# EAGLE design dam1021 (EAGLE 7.4.0)

## Sheet 1 of 2
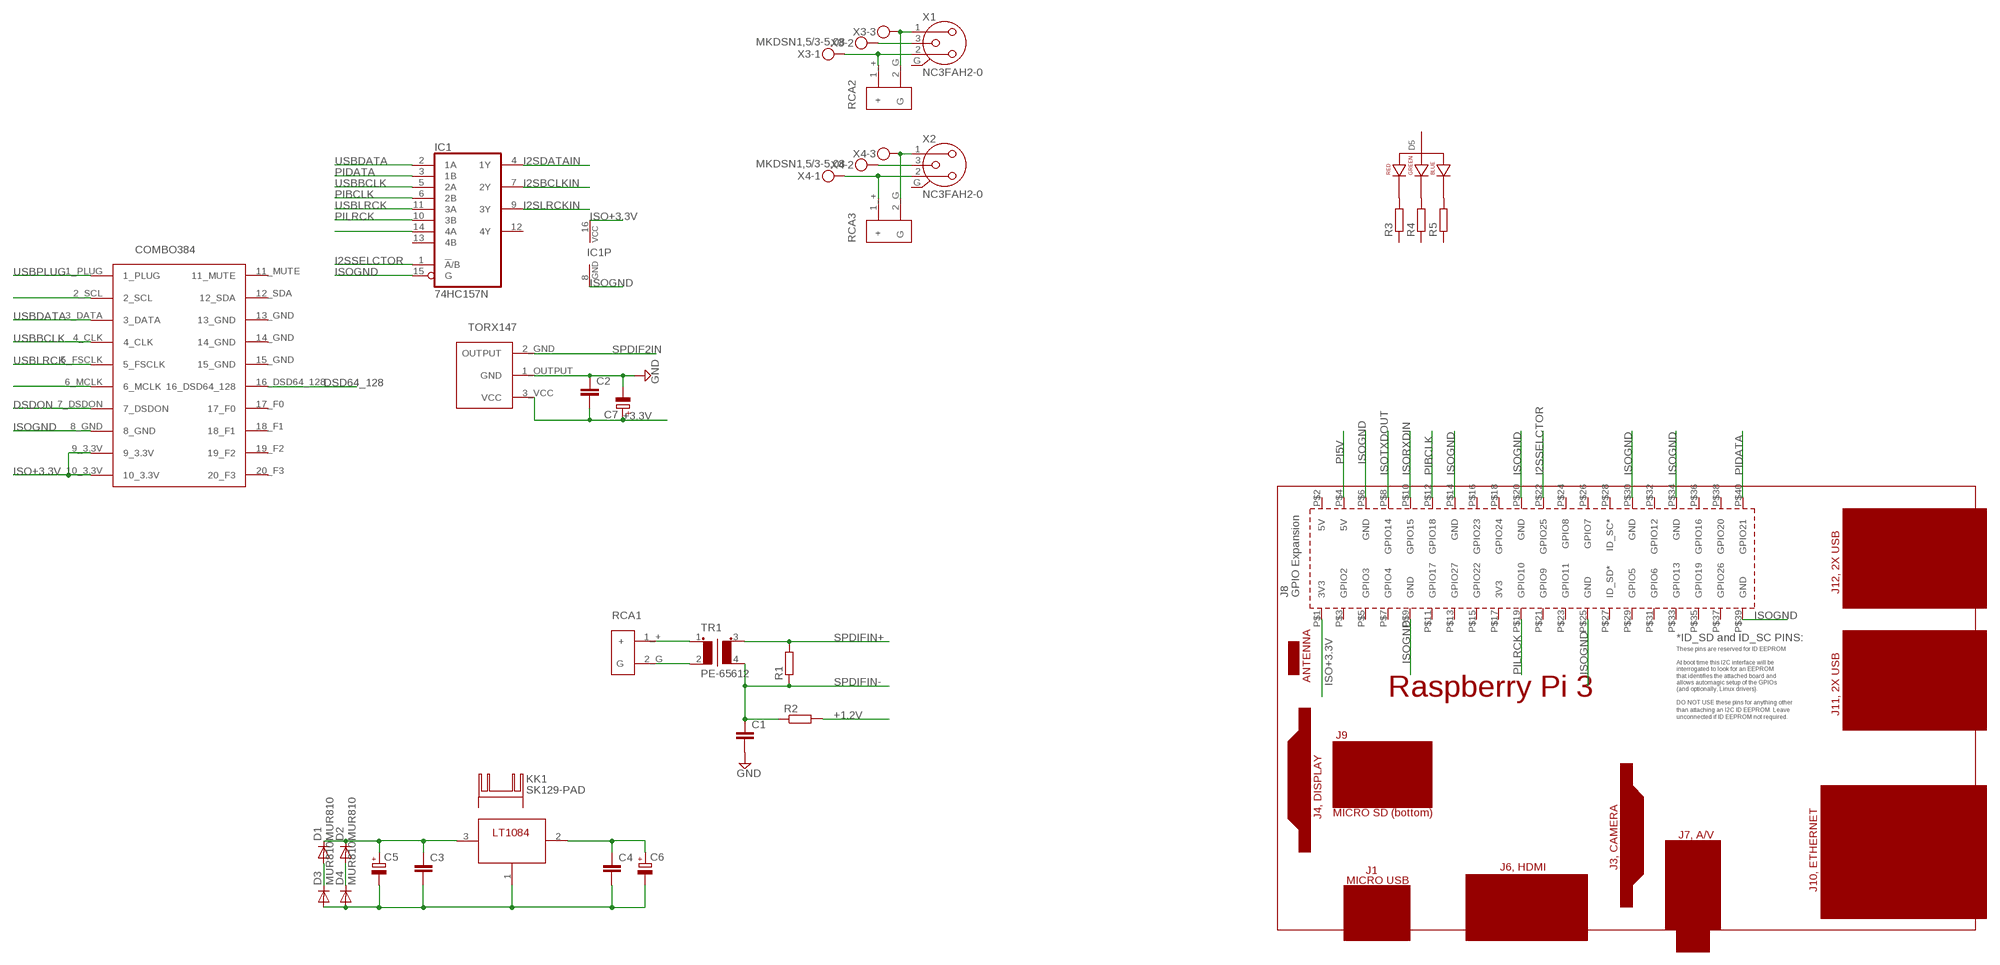
[diagram p0: schematic, sheet 1]

### Parts
C1  C-EU050-035X075  [C050-035X075]
C2  C-EU050-035X075  [C050-035X075]
C3  C-EU050-035X075  [C050-035X075]
C4  C-EU050-035X075  [C050-035X075]
C5  CPOL-EUE7.5-16  [E7,5-16]
C6  CPOL-EUE5-10.5  [E5-10,5]
C7  CPOL-EUE2.5-7  [E2,5-7]
D1  MUR810  [TO220ACS]
D2  MUR810  [TO220ACS]
D3  MUR810  [TO220ACS]
D4  MUR810  [TO220ACS]
D5  LED-RGB-CA-THRUCLEAR  [LED-RGB-THRU]
IC1  74HC157N  [DIL16]
KK1  SK129-PAD  [SK129]
PCB1  RPI3  [RPI3]
R1  R-EU_0207/10  [0207/10]
R2  R-EU_0207/10  [0207/10]
R3  R-EU_0207/10  [0207/10]
R4  R-EU_0207/10  [0207/10]
R5  R-EU_0207/10  [0207/10]
RCA1  RCA  [RCA]
RCA2  RCA  [RCA]
RCA3  RCA  [RCA]
TR1  PE-65612  [PE-65612]
U$2  TORX147  [TORX147]
U$3  COMBO384  [COMBO384]
U$5  LT1084  [TO-220]
X1  NC3FAH2-0  [NC3FAH2-0]
X2  NC3FAH2-0  [NC3FAH2-0]
X3  MKDSN1,5/3-5,08  [MKDSN1,5/3-5,08]
X4  MKDSN1,5/3-5,08  [MKDSN1,5/3-5,08]

### Nets
+1.2V: R2.2 ; also sheet 2
+3.3V: C2.2 C7.+ U$2.3_VCC(VCC) ; also sheet 2
AGND: RCA2.2_G(G) RCA3.2_G(G) X1.1 X2.1 X3.3 X4.3 ; also sheet 2
DSD64_128: U$3.16_DSD64_128
DSDON: U$3.7_DSDON
GND: C1.2 C2.1 C7.- U$2.1_OUTPUT(GND) ; also sheet 2
I2SBCLKIN: IC1.7(2Y) ; also sheet 2
I2SDATAIN: IC1.4(1Y) ; also sheet 2
I2SLRCKIN: IC1.9(3Y) ; also sheet 2
I2SSELCTOR: IC1.1(!A!/B) PCB1.P$22(GPIO25)
ISO+3.3V: IC1.16(VCC) PCB1.P$1(3V3) U$3.9_3.3V U$3.10_3.3V ; also sheet 2
ISOGND: C3.2 C4.2 C5.- C6.- D3.A D4.A IC1.8(GND) IC1.15(G) PCB1.P$6(GND) PCB1.P$9(GND) PCB1.P$14(GND) PCB1.P$20(GND) PCB1.P$25(GND) PCB1.P$30(GND) PCB1.P$34(GND) PCB1.P$39(GND) U$3.8_GND U$5.1 ; also sheet 2
ISORXDIN: PCB1.P$10(GPIO15) ; also sheet 2
ISOTXDOUT: PCB1.P$8(GPIO14) ; also sheet 2
N$1: RCA1.1_+(+) TR1.1
N$2: U$3.2_SCL
N$3: RCA1.2_G(G) TR1.2
N$4: D5.1(RED_CATHODE) R3.2
N$6: U$3.6_MCLK
N$7: D5.3(GREEN_CATHODE) R4.2
N$8: C3.1 C5.+ D1.C D2.C U$5.3
N$9: D1.A D3.C
N$10: D2.A D4.C
N$11: IC1.14(4A)
N$12: D5.4(BLUE_CATHODE) R5.2
N$15: X1.3 X3.2
N$16: RCA2.1_+(+) X1.2 X3.1
N$18: X2.3 X4.2
N$19: RCA3.1_+(+) X2.2 X4.1
PI5V: C4.1 C6.+ PCB1.P$4(5V) U$5.2
PIBCLK: IC1.6(2B) PCB1.P$12(GPIO18)
PIDATA: IC1.3(1B) PCB1.P$40(GPIO21)
PILRCK: IC1.10(3B) PCB1.P$19(GPIO10)
SPDIF2IN: U$2.2_GND(OUTPUT) ; also sheet 2
SPDIFIN+: R1.2 TR1.3 ; also sheet 2
SPDIFIN-: C1.1 R1.1 R2.1 TR1.4 ; also sheet 2
USBBCLK: IC1.5(2A) U$3.4_CLK
USBDATA: IC1.2(1A) U$3.3_DATA
USBLRCK: IC1.11(3A) U$3.5_FSCLK
USBPLUG: U$3.1_PLUG
Unconnected: D5.2(ANODE) IC1.12(4Y) IC1.13(4B) KK1.A2,5(K) KK1.B2,5(K) PCB1.P$2(5V) PCB1.P$3(GPIO2) PCB1.P$5(GPIO3) PCB1.P$7(GPIO4) PCB1.P$11(GPIO17) PCB1.P$13(GPIO27) PCB1.P$15(GPIO22) PCB1.P$16(GPIO23) PCB1.P$17(3V3) PCB1.P$18(GPIO24) PCB1.P$21(GPIO9) PCB1.P$23(GPIO11) PCB1.P$24(GPIO8) PCB1.P$26(GPIO7) PCB1.P$27(ID_SD*) PCB1.P$28(ID_SC*) PCB1.P$29(GPIO5) PCB1.P$31(GPIO6) PCB1.P$32(GPIO12) PCB1.P$33(GPIO13) PCB1.P$35(GPIO19) PCB1.P$36(GPIO16) PCB1.P$37(GPIO26) PCB1.P$38(GPIO20) R3.1 R4.1 R5.1 U$3.11_MUTE U$3.12_SDA U$3.13_GND U$3.14_GND U$3.15_GND U$3.17_F0 U$3.18_F1 U$3.19_F2 U$3.20_F3 X1.G X2.G

## Sheet 2 of 2
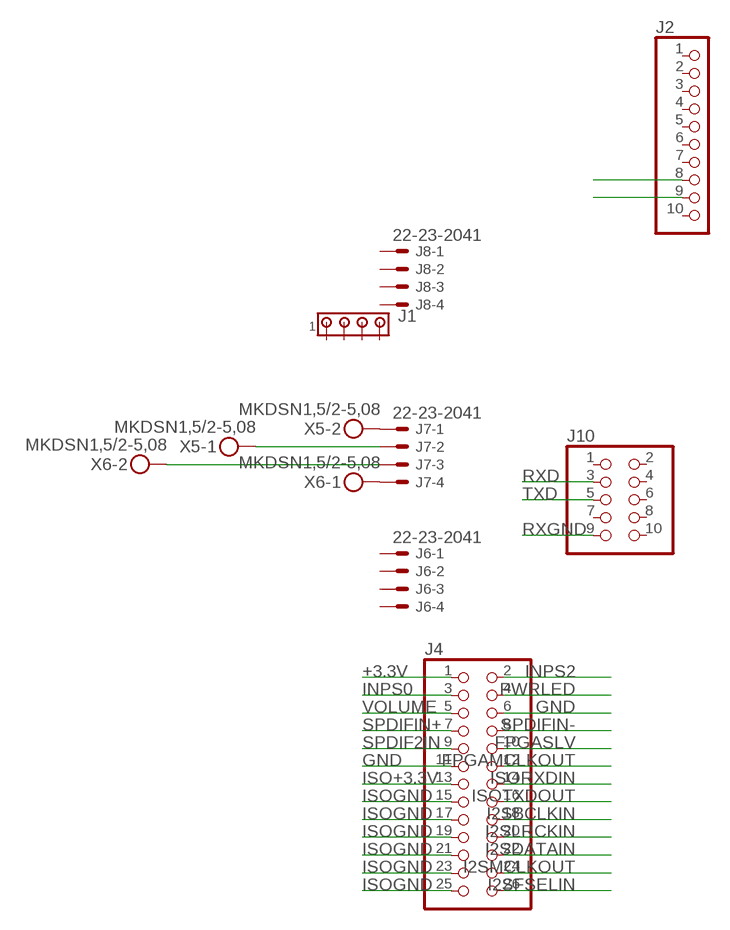
[diagram p1: schematic, sheet 2]

### Parts
J1  MTA04-156  [1X4MTA]
J2  PINHD-1X10  [1X10]
J4  PINHD-2X13  [2X13]
J6  22-23-2041  [22-23-2041]
J7  22-23-2041  [22-23-2041]
J8  22-23-2041  [22-23-2041]
J10  PINHD-2X5  [2X05]
X5  MKDSN1,5/2-5,08  [MKDSN1,5/2-5,08]
X6  MKDSN1,5/2-5,08  [MKDSN1,5/2-5,08]

### Nets
+1.2V: J2.9 ; also sheet 1
+3.3V: J2.8 J4.1 ; also sheet 1
AGND: J7.2 J7.3 X5.1 X6.2 ; also sheet 1
FPGAMCLKOUT: J4.12
FPGASLV: J4.10
GND: J4.6 J4.11 ; also sheet 1
I2SBCLKIN: J4.18 ; also sheet 1
I2SDATAIN: J4.22 ; also sheet 1
I2SFSELIN: J4.26
I2SLRCKIN: J4.20 ; also sheet 1
I2SMCLKOUT: J4.24
INPS0: J4.3
INPS2: J4.2
ISO+3.3V: J4.13 ; also sheet 1
ISOGND: J4.15 J4.17 J4.19 J4.21 J4.23 J4.25 ; also sheet 1
ISORXDIN: J4.14 ; also sheet 1
ISOTXDOUT: J4.16 ; also sheet 1
N$5: J7.1 X5.2
N$13: J7.4 X6.1
PWRLED: J4.4
RXD: J10.3
RXGND: J10.9
SPDIF2IN: J4.9 ; also sheet 1
SPDIFIN+: J4.7 ; also sheet 1
SPDIFIN-: J4.8 ; also sheet 1
TXD: J10.5
VOLUME: J4.5
Unconnected: J1.1 J1.2 J1.3 J1.4 J2.1 J2.2 J2.3 J2.4 J2.5 J2.6 J2.7 J2.10 J6.1 J6.2 J6.3 J6.4 J8.1 J8.2 J8.3 J8.4 J10.1 J10.2 J10.4 J10.6 J10.7 J10.8 J10.10

## Library data of the parts
C1-C4 = Vwvwbg:C-EU: CAPACITOR, European symbol
C5-C7 = Vwvwbg:CPOL-EU: POLARIZED CAPACITOR, European symbol
D1-D4 = diode:MUR810: DIODE
D5 = SparkFun-LED:LED-RGB-CA-THRU: RGB Through-hole common anode SparkFun store front COM-10821 (diffuse) COM-10820 (clear); PROD_ID: DIO-10631
IC1 = 74xx-eu:74*157: Quadruple 2-line to 1-line data SELECTOR/MULTIPLEXER
J1 = con-amp:MTA04-156: AMP connector
J2 = pinhead:PINHD-1X10: PIN HEADER
J4 = pinhead:PINHD-2X13: PIN HEADER
J6-J8 = con-molex:22-23-2041: .100" (2.54mm) Center Header - 4 Pin; MF: MOLEX; MPN: 22-23-2041; OC_FARNELL: 1462920; OC_NEWARK: 38C0355
J10 = pinhead:PINHD-2X5: PIN HEADER
KK1 = heatsinkfix:SK129-PAD: HEATSINK manufacturer Fischer/distributor Buerklin
PCB1 = e14_Rpi3_RevA:RPI3: Device for Raspberry Pi 3 board created by Dave Young for www.element14.com More information and support community is available at https://www.element14.com/community/community/raspberry-pi
R1-R5 = Vwvwbg:R-EU_: RESISTOR, European symbol
RCA1-RCA3 = Vwvwbg:RCA
TR1 = transformer-pulse:PE-65612: TRANSFORMERS FOR DIGITAL AUDIO DATA TRANSMISSION Source: Data sheet <http://ww2.pulseeng.com/products/datasheets/T601.pdf> www.pulseeng.com
U$2 = Vwvwbg:TORX147
U$3 = Vwvwbg:COMBO384
U$5 = GuShH:LT1084
X1 X2 = con-neutrik_ag:NC3: Neutrik Audio Connector XLR SERIES Stereo 1/4" jack Source: www.neutrik.com/; MPN: NC3FAH-2-0; OC_FARNELL: unknown; OC_NEWARK: 11J5829
X3 X4 = con-phoenix-508:MKDSN1,5/3-5,08: MKDSN 1,5/ 3-5,08 Printklemme Nennstrom: 13,5 A Nennspannung: 250 V Rastermaß: 5,08 mm Polzahl: 3 Anschlussart: Schraubanschluss Montage: Löten Anschlussrichtung Leiter/Platine: 0 ° Artikelnummer: 1729131 Source: http://eshop.phoenixcontact.com .. 1729131.pdf
X5 X6 = con-phoenix-508:MKDSN1,5/2-5,08: MKDSN 1,5/ 2-5,08 Printklemme Nennstrom: 13,5 A Nennspannung: 250 V Rastermaß: 5,08 mm Polzahl: 2 Anschlussart: Schraubanschluss Montage: Löten Anschlussrichtung Leiter/Platine: 0 ° Artikelnummer: 1729128 Source: http://eshop.phoenixcontact.com .. 1729128.pdf

## Board
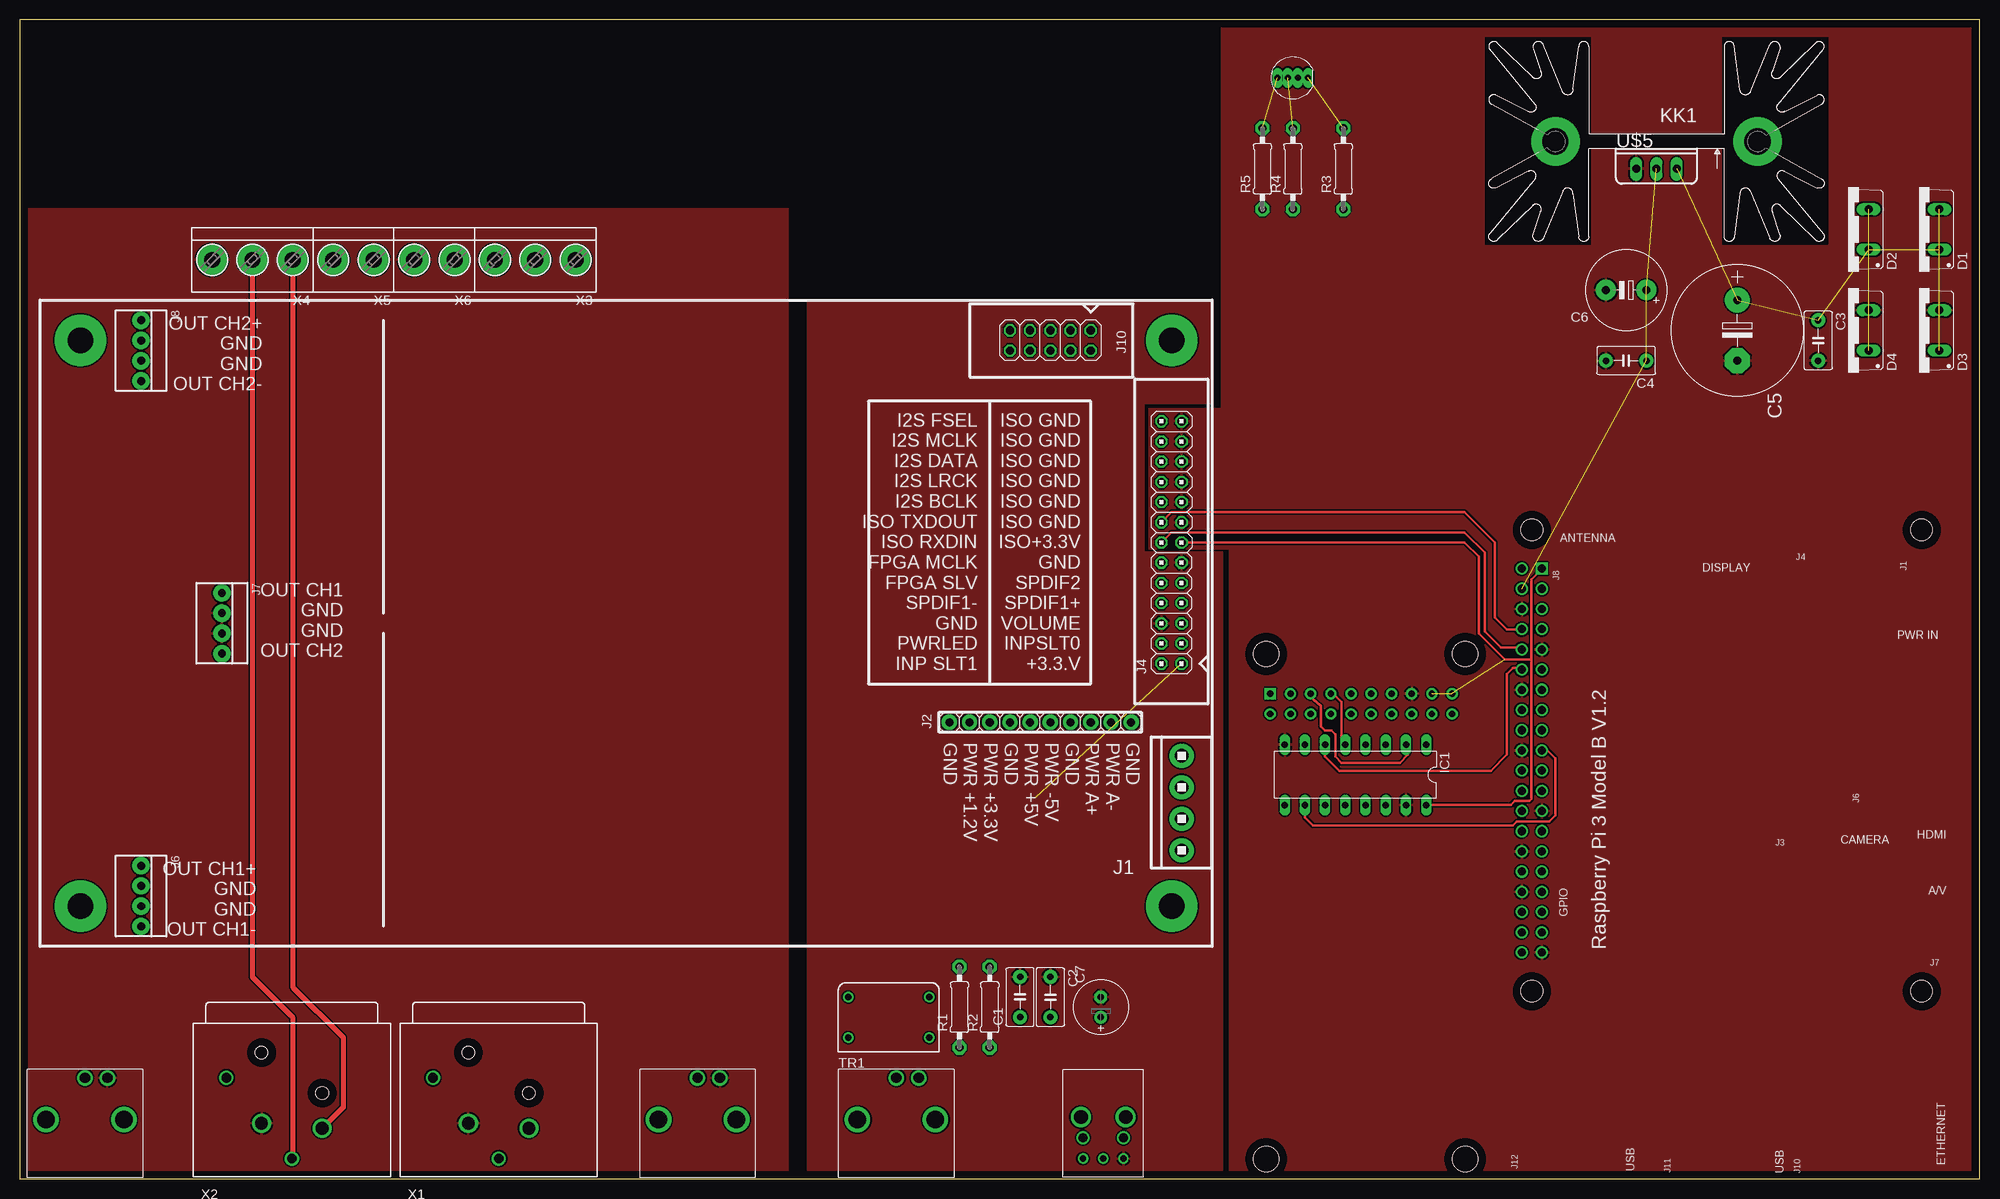
[diagram p2: board, top side]
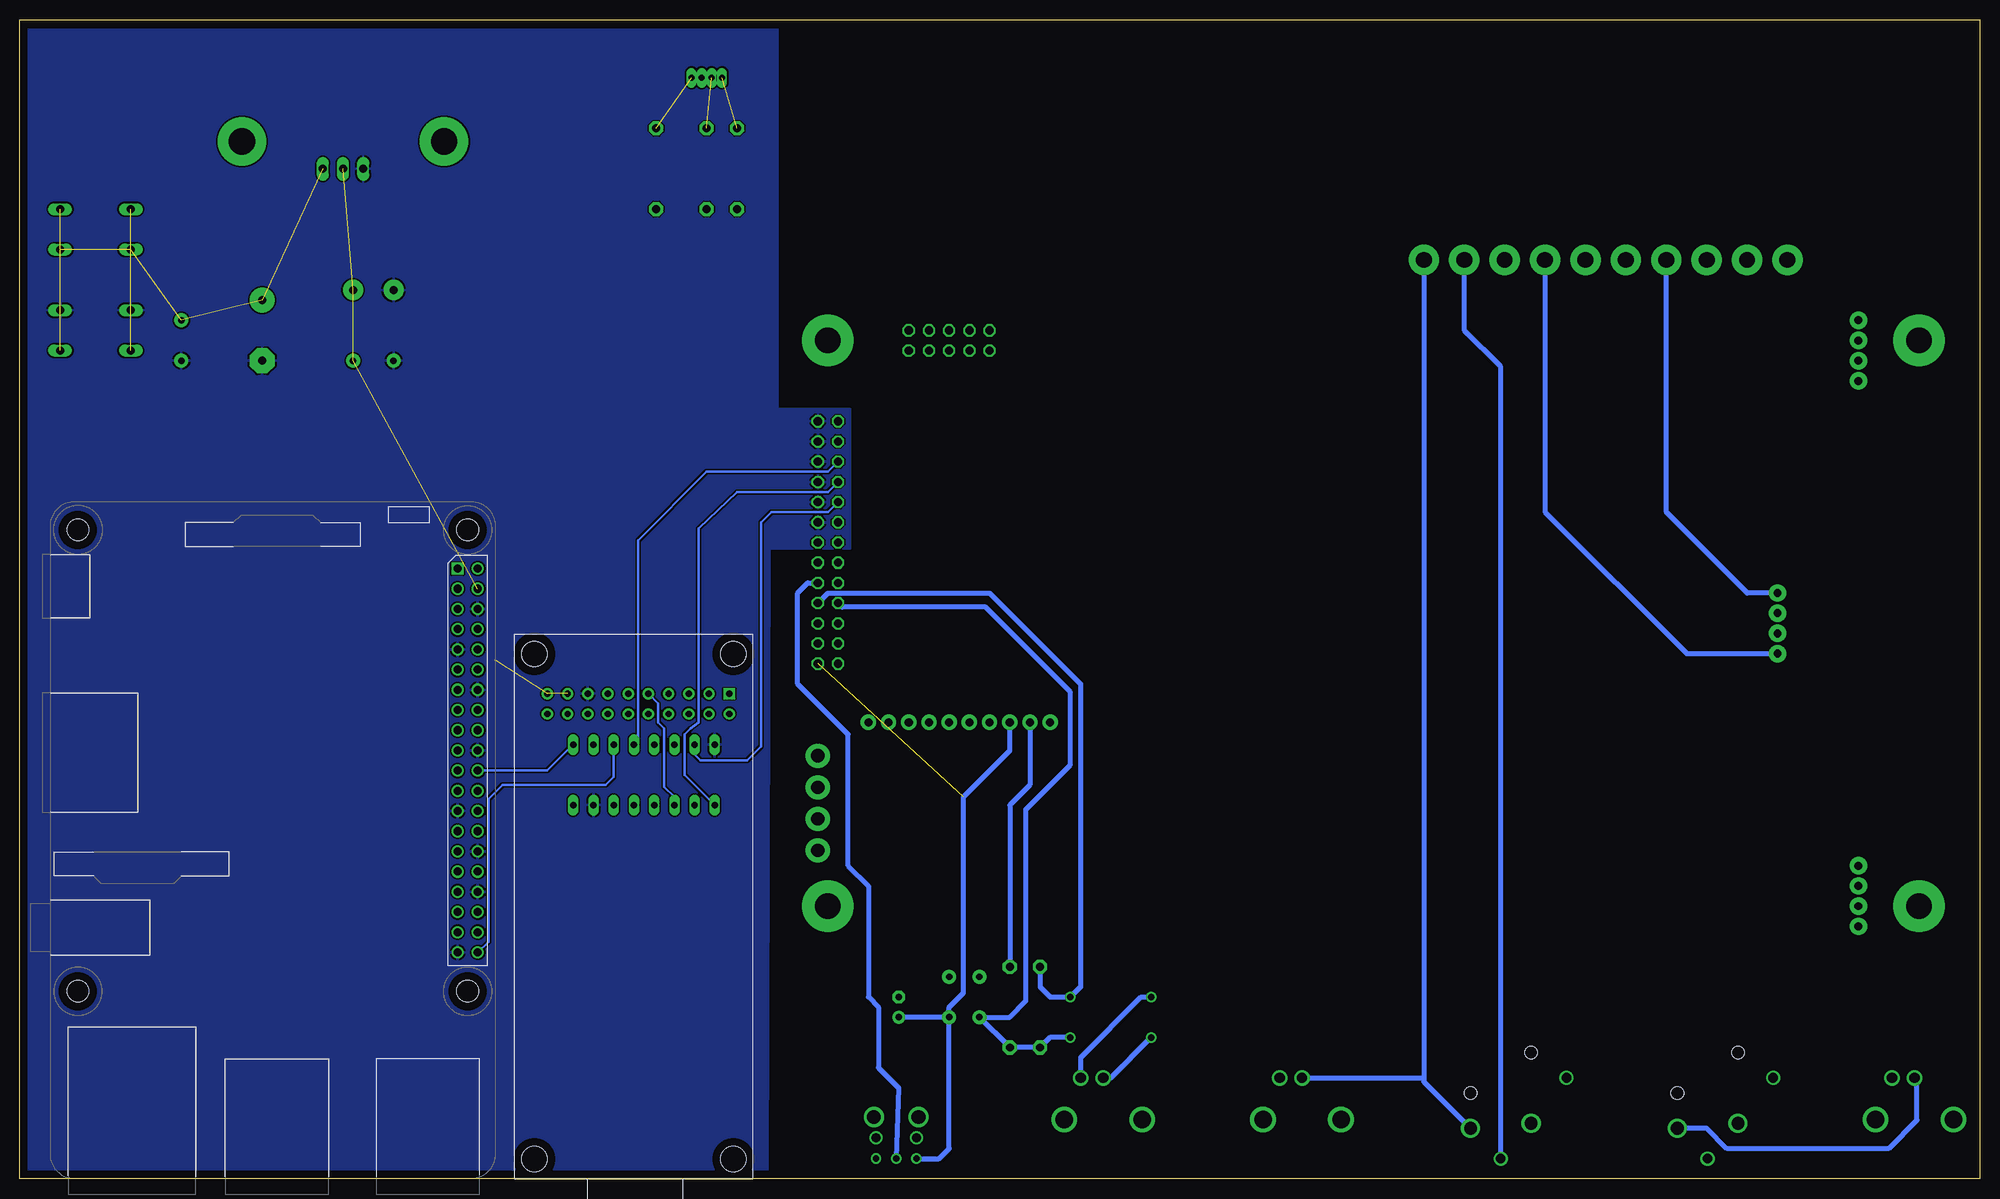
[diagram p3: board, bottom side, seen from below]

Size 246.36 x 145.72 mm. Coordinates in mm from the lower left corner, seen from the top.
Outline: 0,0 246.36,0 246.36,145.72 0,145.72 0,0
Copper layers (1*16): Top 0.035mm / dielectric 1.5mm / Bottom 0.035mm
Design rules "default": minimum track width 10mil, minimum drill 24mil, track to track 8mil, track to pad 8mil, pad to pad 8mil, via to via 8mil, smd to smd 8mil, copper to edge 40mil, drill to drill 8mil, minimum pad ring 10mil, minimum via ring 8mil, stop-mask expansion 4mil, vias tented up to drill 0mil, thermal gap 10mil

### Footprints (pad centres in the part's own frame; a part is rotated, then mirrored left to right if it is on the bottom)
C050-035X075 = drill 0.813 pad 1.778: 1 -2.54,0; 2 2.54,0
E7,5-16 = drill 1.016 pad 3.15: + -3.81,0 | drill 1.016 pad 3.15 octagon: - 3.81,0
E5-10,5 = drill 1.016 pad 2.54: + -2.54,0; - 2.54,0
E2,5-7 = drill 0.813 pad 1.6: + -1.27,0 | drill 0.813 pad 1.6 octagon: - 1.27,0
TO220ACS = drill 1.016 long: A 2.54,-2.54; C -2.54,-2.54
LED-RGB-THRU = drill 0.762 pad 0.889 long: 1 1.905,0; 2 0.635,0; 3 -0.635,0; 4 -1.905,0
DIL16 = drill 0.813 long: 1 -8.89,-3.81; 2 -6.35,-3.81; 3 -3.81,-3.81; 4 -1.27,-3.81; 5 1.27,-3.81; 6 3.81,-3.81; 7 6.35,-3.81; 8 8.89,-3.81; 9 8.89,3.81; 10 6.35,3.81; 11 3.81,3.81; 12 1.27,3.81; 13 -1.27,3.81; 14 -3.81,3.81; 15 -6.35,3.81; 16 -8.89,3.81
1X4MTA = drill 1.676 pad 3.048: 1 5.944,0; 2 1.981,0; 3 -1.981,0; 4 -5.944,0
1X10 = drill 1.016 pad 1.93: 1 -11.43,0; 2 -8.89,0; 3 -6.35,0; 4 -3.81,0; 5 -1.27,0; 6 1.27,0; 7 3.81,0; 8 6.35,0; 9 8.89,0; 10 11.43,0
2X13 = drill 1.016 octagon: 1 -15.24,-1.27; 2 -15.24,1.27; 3 -12.7,-1.27; 4 -12.7,1.27; 5 -10.16,-1.27; 6 -10.16,1.27; 7 -7.62,-1.27; 8 -7.62,1.27; 9 -5.08,-1.27; 10 -5.08,1.27; 11 -2.54,-1.27; 12 -2.54,1.27; 13 0,-1.27; 14 0,1.27; 15 2.54,-1.27; 16 2.54,1.27; 17 5.08,-1.27; 18 5.08,1.27; 19 7.62,-1.27; 20 7.62,1.27; 21 10.16,-1.27; 22 10.16,1.27; 23 12.7,-1.27; 24 12.7,1.27; 25 15.24,-1.27; 26 15.24,1.27
22-23-2041 = drill 1 pad 2.184: 1 -3.81,0; 2 -1.27,0; 3 1.27,0; 4 3.81,0
2X05 = drill 1.016 octagon: 1 -5.08,-1.27; 2 -5.08,1.27; 3 -2.54,-1.27; 4 -2.54,1.27; 5 0,-1.27; 6 0,1.27; 7 2.54,-1.27; 8 2.54,1.27; 9 5.08,-1.27; 10 5.08,1.27
SK129 = drill 3.302 pad 6.096: A2,5 -12.7,-0.889; B2,5 12.7,-0.889
RPI3 = drill 1.016 square: P$1 76.72,51.23 | drill 1.016: P$2 76.733,53.772; P$3 74.193,51.232; P$4 74.193,53.772; P$5 71.653,51.232; P$6 71.653,53.772; P$7 69.113,51.232; P$8 69.113,53.772; P$9 66.573,51.232; P$10 66.573,53.772; P$11 64.033,51.232; P$12 64.033,53.772; P$13 61.493,51.232; P$14 61.493,53.772; P$15 58.953,51.232; P$16 58.953,53.772; P$17 56.413,51.232; P$18 56.413,53.772; P$19 53.873,51.232; P$20 53.873,53.772; P$21 51.333,51.232; P$22 51.333,53.772; P$23 48.793,51.232; P$24 48.793,53.772; P$25 46.253,51.232; P$26 46.253,53.772; P$27 43.713,51.232; P$28 43.713,53.772; P$29 41.173,51.232; P$30 41.173,53.772; P$31 38.633,51.232; P$32 38.633,53.772; P$33 36.093,51.232; P$34 36.093,53.772; P$35 33.553,51.232; P$36 33.553,53.772; P$37 31.013,51.232; P$38 31.013,53.772; P$39 28.473,51.232; P$40 28.473,53.772 | hole 2.75: 81.59,3.5; 23.59,3.5; 81.59,52.5; 23.59,52.5
0207/10 = drill 1 pad 1.778 octagon: 1 -5.08,0; 2 5.08,0
RCA = drill 1.3: 1_+ 0,0; 2_G -2.8,0 | drill 2.2: 3_NC -4.9,5.25; 4_NC 4.9,5.25
PE-65612 = drill 0.8 pad 1.27: 1 -5.08,-2.54; 2 -5.08,2.54; 3 5.08,2.54; 4 5.08,-2.54
TORX147 = drill 0.8: 1_OUTPUT 2.54,0; 2_GND 0,0; 3_VCC -2.54,0 | drill 1.1: 4_NC -2.54,2.625; 5_NC 2.54,2.625 | drill 1.7: P$1 -2.8,5.235; P$2 2.8,5.235
COMBO384 = drill 0.8 pad 1.422 square: 1_PLUG -12,61 | drill 0.8 pad 1.422: 2_SCL -9.46,61; 3_DATA -6.92,61; 4_CLK -4.38,61; 5_FSCLK -1.84,61; 6_MCLK 0.7,61; 7_DSDON 3.24,61; 8_GND 5.78,61; 9_3.3V 8.32,61; 10_3.3V 10.86,61; 11_MUTE -12,58.46; 12_SDA -9.46,58.46; 13_GND -6.92,58.46; 14_GND -4.38,58.46; 15_GND -1.84,58.46; 16_DSD64_128 0.7,58.46; 17_F0 3.24,58.46; 18_F1 5.78,58.46; 19_F2 8.32,58.46; 20_F3 10.86,58.46 | hole 3.2: 12.5,2.5; -12.5,2.5; 12.5,66; -12.5,66
TO-220 = drill 1 long: 1 -2.54,0; 2 0,0; 3 2.54,0
NC3FAH2-0 = drill 1.6: 1 -3.81,0.635; 2 3.81,0 | drill 1.2: 3 0,-3.815; G -8.25,6.355 | hole 1.6: -3.81,9.525; 3.81,4.445
MKDSN1,5/3-5,08 = drill 2 pad 3.81: 1 -7.641,0.025; 2 -2.561,0.025; 3 2.519,0.025
MKDSN1,5/2-5,08 = drill 2 pad 3.81: 1 -2.561,0.025; 2 2.519,0.025

### Placement (x,y rotation side)
C1  125.73,22.86 90 top
C2  129.54,22.86 270 top
C3  226.06,105.41 270 top
C4  201.93,102.87 180 top
C5  215.9,106.68 270 top
C6  201.93,111.76 180 top
C7  135.89,21.59 90 top
D1  238.76,119.38 90 top
D2  229.87,119.38 90 top
D3  238.76,106.68 90 top
D4  229.87,106.68 90 top
D5  160.02,138.43 0 top
IC1  167.89,50.8 180 top
J1  146.05,47.24 90 top
J2  128.27,57.4 180 top
J4  144.78,80.01 90 top
J6  15.24,35.56 270 top
J7  25.4,69.85 270 top
J8  15.24,104.14 270 top
J10  129.54,105.41 180 top
KK1  205.74,129.54 180 top
PCB1  242.57,0 90 top
R1  118.11,21.59 90 top
R2  121.92,21.59 90 top
R3  166.37,127 90 top
R4  160.02,127 90 top
R5  156.21,127 90 top
RCA1  110.19,12.7 180 top
RCA2  85.19,12.7 180 top
RCA3  8.19,12.7 180 top
TR1  109.22,20.32 0 top
U$2  136.19,2.54 0 top
U$3  169.19,0 0 top
U$5  205.74,127 0 top
X1  60.19,6.35 0 top
X2  34.19,6.35 0 top
X3  62.23,115.57 180 top
X4  26.67,115.57 180 top
X5  41.91,115.57 180 top
X6  52.07,115.57 180 top

### Tracks (layer width: path | path; a pad name or v marks a point on that pad's centre or on a via)
+1.2V
  Bottom 0.61: J2.9 119.38,49.53 121.92,46.99 R2.2
+3.3V  (1 unrouted)
  Bottom 0.61: C2.2 C7.+ | U$2.3_VCC 130.81,2.54 129.54,3.81 C2.2 | C2.2 129.54,21.59 127.76,23.37 127.76,48.01 121.92,53.85 J2.8
AGND
  pour Top: -2.54,0 96.52,0 96.52,121.92 -2.54,121.92
GND
  pour Top: 141.22,97.54 149.86,97.54 149.86,110.49 99.06,110.49 99.06,0 151.13,0 151.13,78.74 141.22,78.74
I2SBCLKIN
  Bottom 0.305: J4.18 144.78,83.82 151.89,83.82 153.16,82.55 153.16,54.36 154.94,52.58 160.78,52.58 161.8,53.59 161.8,54.36 IC1.7
I2SDATAIN
  Bottom 0.305: J4.22 144.78,88.9 160.02,88.9 168.66,80.26 168.66,55.37 IC1.4
I2SLRCKIN
  Bottom 0.305: J4.20 144.78,86.36 156.21,86.36 161.04,81.79 161.04,57.4 162.05,56.64 162.81,55.88 162.81,50.8 IC1.9
I2SSELCTOR
  Bottom 0.305: PCB1.P$22 180.06,51.33 IC1.1
ISO+3.3V  (2 unrouted)
  Top 0.305: IC1.16 187.45,46.99 187.96,47.5 189.74,47.5 189.99,47.75 189.99,65.28 | PCB1.P$1 189.99,75.37 189.99,65.28 | J4.13 181.61,80.01 183.39,78.23 183.39,68.58 186.69,65.28 189.99,65.28
ISOGND
  pour Top: 141.99,96.77 151.13,96.77 151.13,145.8 246.38,145.8 246.38,0.25 152.15,0.25 152.15,79.25 141.99,79.25
  pour Bottom: 152.4,0 246.38,0 246.38,144.78 151.13,144.78 151.13,96.77 141.99,96.77 141.99,79.25 152.15,79.25
ISORXDIN
  Top 0.305: J4.14 144.78,81.28 181.61,81.28 184.15,78.74 184.15,68.83 186.18,66.8 188.57,66.8 PCB1.P$10
ISOTXDOUT
  Top 0.305: J4.16 144.78,83.82 181.61,83.82 185.42,80.01 185.42,70.61 186.94,69.09 188.77,69.09 PCB1.P$8
N$1
  Bottom 0.61: RCA1.1_+ 109.22,12.7 TR1.1
N$3
  Bottom 0.61: TR1.2 105.41,22.86 112.99,15.28 RCA1.2_G
N$4  (1 unrouted)
N$5
  Bottom 0.61: J7.1 29.21,73.66 39.37,83.82 39.37,115.52 X5.2
N$7  (1 unrouted)
N$8  (4 unrouted)
N$9  (1 unrouted)
N$10  (1 unrouted)
N$12  (1 unrouted)
N$13
  Bottom 0.61: X6.1 54.63,83.84 36.83,66.04 J7.4
N$15
  Bottom 0.61: X1.3 60.19,102.1 64.77,106.68 64.77,115.52 X3.2
N$16
  Bottom 0.61: X3.1 69.87,12.7 | 69.87,12.7 69.87,12.22 X1.2 | RCA2.1_+ 69.87,12.7
N$18
  Top 0.61: X4.2 29.23,25.38 34.29,20.32 34.29,2.63 X2.3
N$19
  Top 0.61: X4.1 34.31,24.11 40.64,17.78 40.64,8.99 X2.2
  Bottom 0.61: X2.2 34.29,6.35 31.75,3.81 11.43,3.81 7.87,7.37 7.87,12.38 RCA3.1_+
N$24  (via drill 3.2 pad 6.45)
  other vias: 7.62,34.29
N$25  (via drill 3.2 pad 6.45)
  other vias: 7.62,105.41
N$26  (via drill 3.2 pad 6.45)
  other vias: 144.78,105.41
N$27  (via drill 3.2 pad 6.45)
  other vias: 144.78,34.29
PI5V  (3 unrouted)
PIBCLK
  Top 0.305: IC1.6 164.08,53.09 165.86,51.31 184.91,51.31 186.94,53.34 186.94,63.5 187.71,64.26 188.57,64.26 PCB1.P$12
PIDATA
  Bottom 0.305: IC1.3 171.7,50.55 172.72,49.53 185.67,49.53 187.45,47.75 187.45,29.82 PCB1.P$40
PILRCK
  Top 0.305: IC1.10 161.54,45.47 162.56,44.45 187.71,44.45 188.21,44.96 192.28,44.96 193.04,45.72 193.04,52.83 192.02,53.85 191.36,53.85 PCB1.P$19
SPDIF2IN
  Bottom 0.61: U$2.2_GND 135.89,11.43 138.43,13.97 138.43,21.59 139.7,22.86 139.7,36.83 142.24,39.37 142.24,55.88 148.59,62.23 148.59,73.66 147.32,74.93 J4.9
SPDIFIN+
  Bottom 0.61: J4.7 144.78,73.66 124.46,73.66 113.03,62.23 113.03,24.13 TR1.3 116.84,22.86 118.11,24.13 R1.2
SPDIFIN-
  Bottom 0.61: TR1.4 116.84,17.78 R1.1 R2.1 C1.1 121.92,20.32 119.89,22.35 119.89,46.48 114.3,52.07 114.3,61.21 124.97,71.88 143,71.88 J4.8
USBBCLK
  Top 0.305: U$3.4_CLK 165.06,61 166.12,59.94 166.12,55.12 IC1.5
USBDATA
  Top 0.305: U$3.3_DATA 161.76,61 163.58,59.44 163.58,56.9 164.08,56.39 164.85,56.39 165.35,55.88 165.35,53.09 166.12,52.32 173.48,52.32 174.5,53.34 174.5,54.36 IC1.2
USBLRCK
  Bottom 0.305: IC1.11 164.08,48.01 165.35,49.28 165.35,56.64 166.12,57.4 166.12,59.77 U$3.5_FSCLK

### Text on the board
tPlace: OUT CH2+ / GND / GND / OUT CH2- | I2S FSEL / I2S MCLK / I2S DATA / I2S LRCK / I2S BCLK / ISO TXDOUT / ISO RXDIN / FPGA MCLK / FPGA SLV / SPDIF1- / GND / PWRLED / INP SLT1 | ISO GND / ISO GND / ISO GND / ISO GND / ISO GND / ISO GND / ISO+3.3V / GND / SPDIF2 / SPDIF1+ / VOLUME / INPSLT0 / +3.3.V | OUT CH1 / GND / GND / OUT CH2 | GND / PWR A- / PWR A+ / GND / PWR -5V / PWR +5V / GND / PWR +3.3V / PWR +1.2V / GND | OUT CH1+ / GND / GND / OUT CH1-